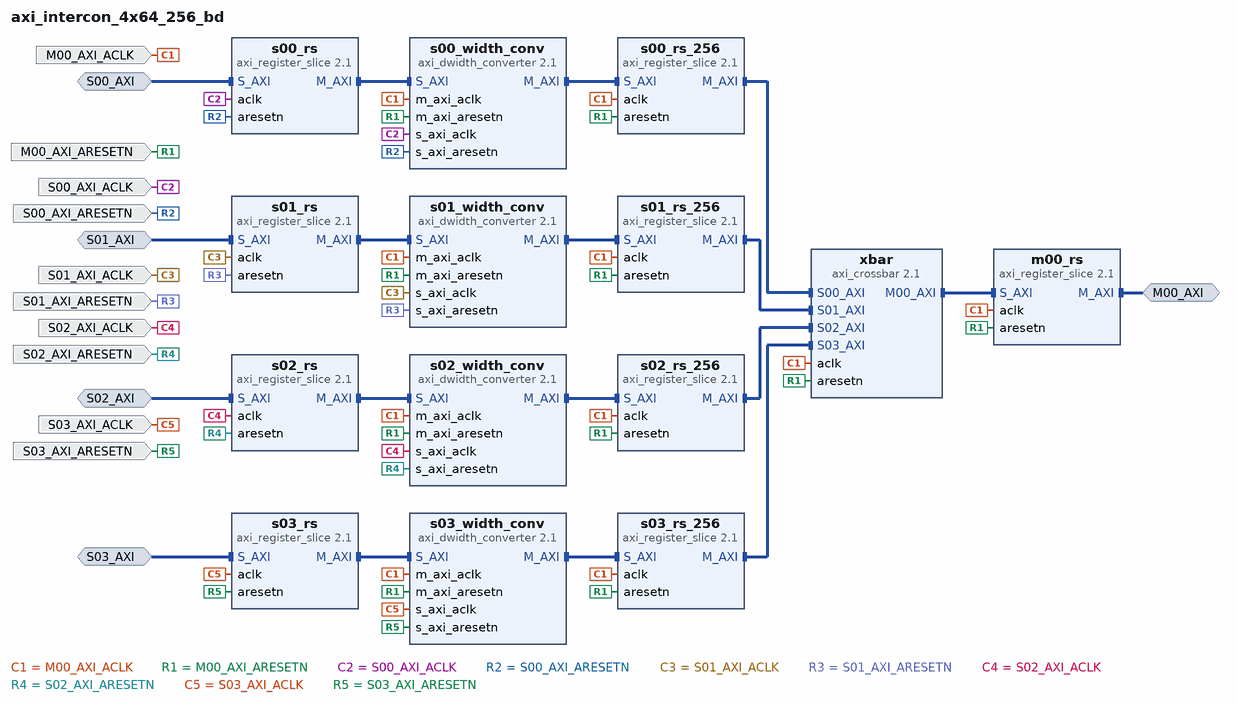
[diagram p0: block diagram of the top level]
# Vivado block design axi_intercon_4x64_256_bd, Vivado 2015.4
create_bd_design axi_intercon_4x64_256_bd

create_bd_intf_port -mode Master -vlnv xilinx.com:interface:aximm_rtl:1.0 M00_AXI
set_property -dict [list \
  CONFIG.DATA_WIDTH 128 \
  CONFIG.PROTOCOL AXI4 \
  CONFIG.FREQ_HZ 100000000 \
  CONFIG.ADDR_WIDTH 32 \
  CONFIG.NUM_READ_OUTSTANDING 2 \
  CONFIG.NUM_WRITE_OUTSTANDING 2 \
  CONFIG.CLK_DOMAIN axi_intercon_4x64_128_bd_M00_ACLK \
] [get_bd_intf_ports M00_AXI]
create_bd_intf_port -mode Slave -vlnv xilinx.com:interface:aximm_rtl:1.0 S00_AXI
set_property -dict [list \
  CONFIG.DATA_WIDTH 64 \
  CONFIG.PROTOCOL AXI4 \
  CONFIG.FREQ_HZ 100000000 \
  CONFIG.ID_WIDTH 1 \
  CONFIG.ADDR_WIDTH 32 \
  CONFIG.AWUSER_WIDTH 0 \
  CONFIG.ARUSER_WIDTH 0 \
  CONFIG.WUSER_WIDTH 0 \
  CONFIG.RUSER_WIDTH 0 \
  CONFIG.BUSER_WIDTH 0 \
  CONFIG.READ_WRITE_MODE READ_WRITE \
  CONFIG.HAS_BURST 1 \
  CONFIG.HAS_LOCK 1 \
  CONFIG.HAS_PROT 1 \
  CONFIG.HAS_CACHE 1 \
  CONFIG.HAS_QOS 1 \
  CONFIG.HAS_REGION 1 \
  CONFIG.HAS_WSTRB 1 \
  CONFIG.HAS_BRESP 1 \
  CONFIG.HAS_RRESP 1 \
  CONFIG.SUPPORTS_NARROW_BURST 1 \
  CONFIG.NUM_READ_OUTSTANDING 2 \
  CONFIG.NUM_WRITE_OUTSTANDING 2 \
  CONFIG.MAX_BURST_LENGTH 256 \
  CONFIG.CLK_DOMAIN axi_intercon_4x64_128_bd_S00_ACLK \
] [get_bd_intf_ports S00_AXI]
create_bd_intf_port -mode Slave -vlnv xilinx.com:interface:aximm_rtl:1.0 S01_AXI
set_property -dict [list \
  CONFIG.DATA_WIDTH 64 \
  CONFIG.PROTOCOL AXI4 \
  CONFIG.FREQ_HZ 100000000 \
  CONFIG.ID_WIDTH 1 \
  CONFIG.ADDR_WIDTH 32 \
  CONFIG.AWUSER_WIDTH 0 \
  CONFIG.ARUSER_WIDTH 0 \
  CONFIG.WUSER_WIDTH 0 \
  CONFIG.RUSER_WIDTH 0 \
  CONFIG.BUSER_WIDTH 0 \
  CONFIG.READ_WRITE_MODE READ_WRITE \
  CONFIG.HAS_BURST 1 \
  CONFIG.HAS_LOCK 1 \
  CONFIG.HAS_PROT 1 \
  CONFIG.HAS_CACHE 1 \
  CONFIG.HAS_QOS 1 \
  CONFIG.HAS_REGION 1 \
  CONFIG.HAS_WSTRB 1 \
  CONFIG.HAS_BRESP 1 \
  CONFIG.HAS_RRESP 1 \
  CONFIG.SUPPORTS_NARROW_BURST 1 \
  CONFIG.NUM_READ_OUTSTANDING 2 \
  CONFIG.NUM_WRITE_OUTSTANDING 2 \
  CONFIG.MAX_BURST_LENGTH 256 \
  CONFIG.CLK_DOMAIN axi_intercon_4x64_128_bd_S01_ACLK \
] [get_bd_intf_ports S01_AXI]
create_bd_intf_port -mode Slave -vlnv xilinx.com:interface:aximm_rtl:1.0 S02_AXI
set_property -dict [list \
  CONFIG.DATA_WIDTH 64 \
  CONFIG.PROTOCOL AXI4 \
  CONFIG.FREQ_HZ 100000000 \
  CONFIG.ID_WIDTH 1 \
  CONFIG.ADDR_WIDTH 32 \
  CONFIG.AWUSER_WIDTH 0 \
  CONFIG.ARUSER_WIDTH 0 \
  CONFIG.WUSER_WIDTH 0 \
  CONFIG.RUSER_WIDTH 0 \
  CONFIG.BUSER_WIDTH 0 \
  CONFIG.READ_WRITE_MODE READ_WRITE \
  CONFIG.HAS_BURST 1 \
  CONFIG.HAS_LOCK 1 \
  CONFIG.HAS_PROT 1 \
  CONFIG.HAS_CACHE 1 \
  CONFIG.HAS_QOS 1 \
  CONFIG.HAS_REGION 1 \
  CONFIG.HAS_WSTRB 1 \
  CONFIG.HAS_BRESP 1 \
  CONFIG.HAS_RRESP 1 \
  CONFIG.SUPPORTS_NARROW_BURST 1 \
  CONFIG.NUM_READ_OUTSTANDING 2 \
  CONFIG.NUM_WRITE_OUTSTANDING 2 \
  CONFIG.MAX_BURST_LENGTH 256 \
  CONFIG.CLK_DOMAIN axi_intercon_4x64_128_bd_S00_ACLK \
] [get_bd_intf_ports S02_AXI]
create_bd_intf_port -mode Slave -vlnv xilinx.com:interface:aximm_rtl:1.0 S03_AXI
set_property -dict [list \
  CONFIG.DATA_WIDTH 64 \
  CONFIG.PROTOCOL AXI4 \
  CONFIG.FREQ_HZ 100000000 \
  CONFIG.ID_WIDTH 1 \
  CONFIG.ADDR_WIDTH 32 \
  CONFIG.AWUSER_WIDTH 0 \
  CONFIG.ARUSER_WIDTH 0 \
  CONFIG.WUSER_WIDTH 0 \
  CONFIG.RUSER_WIDTH 0 \
  CONFIG.BUSER_WIDTH 0 \
  CONFIG.READ_WRITE_MODE READ_WRITE \
  CONFIG.HAS_BURST 1 \
  CONFIG.HAS_LOCK 1 \
  CONFIG.HAS_PROT 1 \
  CONFIG.HAS_CACHE 1 \
  CONFIG.HAS_QOS 1 \
  CONFIG.HAS_REGION 1 \
  CONFIG.HAS_WSTRB 1 \
  CONFIG.HAS_BRESP 1 \
  CONFIG.HAS_RRESP 1 \
  CONFIG.SUPPORTS_NARROW_BURST 1 \
  CONFIG.NUM_READ_OUTSTANDING 2 \
  CONFIG.NUM_WRITE_OUTSTANDING 2 \
  CONFIG.MAX_BURST_LENGTH 256 \
  CONFIG.CLK_DOMAIN axi_intercon_4x64_128_bd_S00_ACLK \
] [get_bd_intf_ports S03_AXI]
create_bd_port -dir I -type clk M00_AXI_ACLK
set_property -dict [list \
  CONFIG.FREQ_HZ 100000000 \
  CONFIG.CLK_DOMAIN axi_intercon_4x64_128_bd_M00_ACLK \
  CONFIG.ASSOCIATED_RESET M00_AXI_ARESETN \
] [get_bd_ports M00_AXI_ACLK]
create_bd_port -dir I -type rst M00_AXI_ARESETN
create_bd_port -dir I -type clk S00_AXI_ACLK
set_property -dict [list \
  CONFIG.FREQ_HZ 100000000 \
  CONFIG.CLK_DOMAIN axi_intercon_4x64_128_bd_S00_ACLK \
  CONFIG.ASSOCIATED_BUSIF S00_AXI \
  CONFIG.ASSOCIATED_RESET S00_AXI_ARESETN \
] [get_bd_ports S00_AXI_ACLK]
create_bd_port -dir I -type rst S00_AXI_ARESETN
create_bd_port -dir I -type clk S01_AXI_ACLK
set_property -dict [list \
  CONFIG.FREQ_HZ 100000000 \
  CONFIG.CLK_DOMAIN axi_intercon_4x64_128_bd_S01_ACLK \
  CONFIG.ASSOCIATED_BUSIF S01_AXI \
  CONFIG.ASSOCIATED_RESET S01_AXI_ARESETN \
] [get_bd_ports S01_AXI_ACLK]
create_bd_port -dir I -type rst S01_AXI_ARESETN
create_bd_port -dir I -type clk S02_AXI_ACLK
set_property -dict [list \
  CONFIG.FREQ_HZ 100000000 \
  CONFIG.CLK_DOMAIN axi_intercon_4x64_128_bd_S00_ACLK \
  CONFIG.ASSOCIATED_BUSIF S02_AXI \
  CONFIG.ASSOCIATED_RESET S00_AXI_ARESETN:S02_AXI_ARESETN \
] [get_bd_ports S02_AXI_ACLK]
create_bd_port -dir I -type rst S02_AXI_ARESETN
create_bd_port -dir I -type clk S03_AXI_ACLK
set_property -dict [list \
  CONFIG.FREQ_HZ 100000000 \
  CONFIG.CLK_DOMAIN axi_intercon_4x64_128_bd_S00_ACLK \
  CONFIG.ASSOCIATED_BUSIF S02_AXI:S03_AXI \
  CONFIG.ASSOCIATED_RESET S00_AXI_ARESETN:S02_AXI_ARESETN:S03_AXI_ARESETN \
] [get_bd_ports S03_AXI_ACLK]
create_bd_port -dir I -type rst S03_AXI_ARESETN

create_bd_cell -type ip -vlnv xilinx.com:ip:axi_register_slice:2.1 m00_rs
set_property -dict {CONFIG.DATA_WIDTH 128 CONFIG.ID_WIDTH 4 CONFIG.REG_AW 1 CONFIG.REG_AR 1 CONFIG.REG_B 1} [get_bd_cells m00_rs]
create_bd_cell -type ip -vlnv xilinx.com:ip:axi_register_slice:2.1 s00_rs
set_property -dict {CONFIG.REG_AW 1 CONFIG.REG_AR 1 CONFIG.REG_R 1 CONFIG.REG_W 1 CONFIG.REG_B 1} [get_bd_cells s00_rs]
create_bd_cell -type ip -vlnv xilinx.com:ip:axi_dwidth_converter:2.1 s00_width_conv
set_property -dict [list \
  CONFIG.SI_DATA_WIDTH 64 \
  CONFIG.MI_DATA_WIDTH 128 \
  CONFIG.FIFO_MODE 2 \
  CONFIG.ACLK_ASYNC 1 \
  CONFIG.SYNCHRONIZATION_STAGES 2 \
] [get_bd_cells s00_width_conv]
create_bd_cell -type ip -vlnv xilinx.com:ip:axi_register_slice:2.1 s01_rs
set_property -dict {CONFIG.REG_AW 1 CONFIG.REG_AR 1 CONFIG.REG_R 1 CONFIG.REG_W 1 CONFIG.REG_B 1} [get_bd_cells s01_rs]
create_bd_cell -type ip -vlnv xilinx.com:ip:axi_dwidth_converter:2.1 s01_width_conv
set_property -dict [list \
  CONFIG.SI_DATA_WIDTH 64 \
  CONFIG.MI_DATA_WIDTH 128 \
  CONFIG.FIFO_MODE 2 \
  CONFIG.ACLK_ASYNC 1 \
  CONFIG.SYNCHRONIZATION_STAGES 2 \
] [get_bd_cells s01_width_conv]
create_bd_cell -type ip -vlnv xilinx.com:ip:axi_crossbar:2.1 xbar
set_property -dict [list \
  CONFIG.NUM_SI 4 \
  CONFIG.NUM_MI 1 \
  CONFIG.STRATEGY 2 \
  CONFIG.DATA_WIDTH 128 \
  CONFIG.CONNECTIVITY_MODE SAMD \
  CONFIG.ID_WIDTH 4 \
  CONFIG.S00_SINGLE_THREAD 0 \
  CONFIG.S01_BASE_ID 0x00000004 \
  CONFIG.S02_BASE_ID 0x00000008 \
  CONFIG.S03_BASE_ID 0x0000000c \
  CONFIG.S04_BASE_ID 0x00000010 \
  CONFIG.S05_BASE_ID 0x00000014 \
  CONFIG.S06_BASE_ID 0x00000018 \
  CONFIG.S07_BASE_ID 0x0000001c \
  CONFIG.S08_BASE_ID 0x00000020 \
  CONFIG.S09_BASE_ID 0x00000024 \
  CONFIG.S10_BASE_ID 0x00000028 \
  CONFIG.S11_BASE_ID 0x0000002c \
  CONFIG.S12_BASE_ID 0x00000030 \
  CONFIG.S13_BASE_ID 0x00000034 \
  CONFIG.S14_BASE_ID 0x00000038 \
  CONFIG.S15_BASE_ID 0x0000003c \
] [get_bd_cells xbar]
create_bd_cell -type ip -vlnv xilinx.com:ip:axi_register_slice:2.1 s01_rs_256
set_property -dict {CONFIG.REG_AW 1 CONFIG.REG_AR 1 CONFIG.REG_R 1 CONFIG.REG_W 1 CONFIG.REG_B 1} [get_bd_cells s01_rs_256]
create_bd_cell -type ip -vlnv xilinx.com:ip:axi_register_slice:2.1 s00_rs_256
set_property -dict {CONFIG.REG_AW 1 CONFIG.REG_AR 1 CONFIG.REG_R 1 CONFIG.REG_W 1 CONFIG.REG_B 1} [get_bd_cells s00_rs_256]
create_bd_cell -type ip -vlnv xilinx.com:ip:axi_register_slice:2.1 s02_rs
set_property -dict {CONFIG.REG_AW 1 CONFIG.REG_AR 1 CONFIG.REG_R 1 CONFIG.REG_W 1 CONFIG.REG_B 1} [get_bd_cells s02_rs]
create_bd_cell -type ip -vlnv xilinx.com:ip:axi_register_slice:2.1 s03_rs
set_property -dict {CONFIG.REG_AW 1 CONFIG.REG_AR 1 CONFIG.REG_R 1 CONFIG.REG_W 1 CONFIG.REG_B 1} [get_bd_cells s03_rs]
create_bd_cell -type ip -vlnv xilinx.com:ip:axi_dwidth_converter:2.1 s02_width_conv
set_property -dict [list \
  CONFIG.SI_DATA_WIDTH 64 \
  CONFIG.MI_DATA_WIDTH 128 \
  CONFIG.FIFO_MODE 2 \
  CONFIG.ACLK_ASYNC 1 \
  CONFIG.SYNCHRONIZATION_STAGES 2 \
] [get_bd_cells s02_width_conv]
create_bd_cell -type ip -vlnv xilinx.com:ip:axi_dwidth_converter:2.1 s03_width_conv
set_property -dict [list \
  CONFIG.SI_DATA_WIDTH 64 \
  CONFIG.MI_DATA_WIDTH 128 \
  CONFIG.FIFO_MODE 2 \
  CONFIG.ACLK_ASYNC 1 \
  CONFIG.SYNCHRONIZATION_STAGES 2 \
] [get_bd_cells s03_width_conv]
create_bd_cell -type ip -vlnv xilinx.com:ip:axi_register_slice:2.1 s03_rs_256
set_property -dict {CONFIG.REG_AW 1 CONFIG.REG_AR 1 CONFIG.REG_R 1 CONFIG.REG_W 1 CONFIG.REG_B 1} [get_bd_cells s03_rs_256]
create_bd_cell -type ip -vlnv xilinx.com:ip:axi_register_slice:2.1 s02_rs_256
set_property -dict {CONFIG.REG_AW 1 CONFIG.REG_AR 1 CONFIG.REG_R 1 CONFIG.REG_W 1 CONFIG.REG_B 1} [get_bd_cells s02_rs_256]

# ---- connections ----

connect_bd_intf_net [get_bd_intf_pins s00_rs/M_AXI] [get_bd_intf_pins s00_width_conv/S_AXI]
connect_bd_intf_net [get_bd_intf_pins s01_rs/M_AXI] [get_bd_intf_pins s01_width_conv/S_AXI]
connect_bd_intf_net [get_bd_intf_pins m00_rs/S_AXI] [get_bd_intf_pins xbar/M00_AXI]
connect_bd_intf_net [get_bd_intf_pins s00_rs_256/M_AXI] [get_bd_intf_pins xbar/S00_AXI]
connect_bd_intf_net [get_bd_intf_pins s01_rs_256/M_AXI] [get_bd_intf_pins xbar/S01_AXI]
connect_bd_intf_net [get_bd_intf_pins s00_width_conv/M_AXI] [get_bd_intf_pins s00_rs_256/S_AXI]
connect_bd_intf_net [get_bd_intf_pins s01_width_conv/M_AXI] [get_bd_intf_pins s01_rs_256/S_AXI]
connect_bd_intf_net [get_bd_intf_pins s02_rs/M_AXI] [get_bd_intf_pins s02_width_conv/S_AXI]
connect_bd_intf_net [get_bd_intf_pins s03_rs/M_AXI] [get_bd_intf_pins s03_width_conv/S_AXI]
connect_bd_intf_net [get_bd_intf_pins s02_width_conv/M_AXI] [get_bd_intf_pins s02_rs_256/S_AXI]
connect_bd_intf_net [get_bd_intf_pins s03_width_conv/M_AXI] [get_bd_intf_pins s03_rs_256/S_AXI]
connect_bd_intf_net [get_bd_intf_pins s02_rs_256/M_AXI] [get_bd_intf_pins xbar/S02_AXI]
connect_bd_intf_net [get_bd_intf_pins s03_rs_256/M_AXI] [get_bd_intf_pins xbar/S03_AXI]
connect_bd_intf_net [get_bd_intf_ports M00_AXI] [get_bd_intf_pins m00_rs/M_AXI]
connect_bd_intf_net [get_bd_intf_ports S00_AXI] [get_bd_intf_pins s00_rs/S_AXI]
connect_bd_intf_net [get_bd_intf_ports S01_AXI] [get_bd_intf_pins s01_rs/S_AXI]
connect_bd_intf_net [get_bd_intf_ports S02_AXI] [get_bd_intf_pins s02_rs/S_AXI]
connect_bd_intf_net [get_bd_intf_ports S03_AXI] [get_bd_intf_pins s03_rs/S_AXI]
connect_bd_net [get_bd_ports M00_AXI_ACLK] \
  [get_bd_pins xbar/aclk] [get_bd_pins m00_rs/aclk] [get_bd_pins s00_rs_256/aclk] [get_bd_pins s01_rs_256/aclk] \
  [get_bd_pins s01_width_conv/m_axi_aclk] [get_bd_pins s00_width_conv/m_axi_aclk] [get_bd_pins s02_width_conv/m_axi_aclk] \
  [get_bd_pins s03_width_conv/m_axi_aclk] [get_bd_pins s02_rs_256/aclk] [get_bd_pins s03_rs_256/aclk]
connect_bd_net [get_bd_ports M00_AXI_ARESETN] \
  [get_bd_pins xbar/aresetn] [get_bd_pins m00_rs/aresetn] [get_bd_pins s00_rs_256/aresetn] [get_bd_pins s01_rs_256/aresetn] \
  [get_bd_pins s01_width_conv/m_axi_aresetn] [get_bd_pins s00_width_conv/m_axi_aresetn] \
  [get_bd_pins s02_width_conv/m_axi_aresetn] [get_bd_pins s03_width_conv/m_axi_aresetn] [get_bd_pins s02_rs_256/aresetn] \
  [get_bd_pins s03_rs_256/aresetn]
connect_bd_net [get_bd_ports S00_AXI_ACLK] [get_bd_pins s00_rs/aclk] [get_bd_pins s00_width_conv/s_axi_aclk]
connect_bd_net [get_bd_ports S00_AXI_ARESETN] [get_bd_pins s00_rs/aresetn] [get_bd_pins s00_width_conv/s_axi_aresetn]
connect_bd_net [get_bd_ports S01_AXI_ACLK] [get_bd_pins s01_rs/aclk] [get_bd_pins s01_width_conv/s_axi_aclk]
connect_bd_net [get_bd_ports S01_AXI_ARESETN] [get_bd_pins s01_rs/aresetn] [get_bd_pins s01_width_conv/s_axi_aresetn]
connect_bd_net [get_bd_ports S02_AXI_ACLK] [get_bd_pins s02_rs/aclk] [get_bd_pins s02_width_conv/s_axi_aclk]
connect_bd_net [get_bd_ports S02_AXI_ARESETN] [get_bd_pins s02_rs/aresetn] [get_bd_pins s02_width_conv/s_axi_aresetn]
connect_bd_net [get_bd_ports S03_AXI_ACLK] [get_bd_pins s03_rs/aclk] [get_bd_pins s03_width_conv/s_axi_aclk]
connect_bd_net [get_bd_ports S03_AXI_ARESETN] [get_bd_pins s03_rs/aresetn] [get_bd_pins s03_width_conv/s_axi_aresetn]

# ---- address map ----
assign_bd_address -offset 0x00000000 -range 1G -target_address_space [get_bd_addr_spaces S00_AXI] [get_bd_addr_segs M00_AXI/Reg]
assign_bd_address -offset 0x00000000 -range 1G -target_address_space [get_bd_addr_spaces S01_AXI] [get_bd_addr_segs M00_AXI/Reg]
assign_bd_address -offset 0x00000000 -range 1G -target_address_space [get_bd_addr_spaces S02_AXI] [get_bd_addr_segs M00_AXI/Reg]
assign_bd_address -offset 0x00000000 -range 1G -target_address_space [get_bd_addr_spaces S03_AXI] [get_bd_addr_segs M00_AXI/Reg]

validate_bd_design
save_bd_design
